# Altium schematic sheet level_shifter.SchDoc
size A4
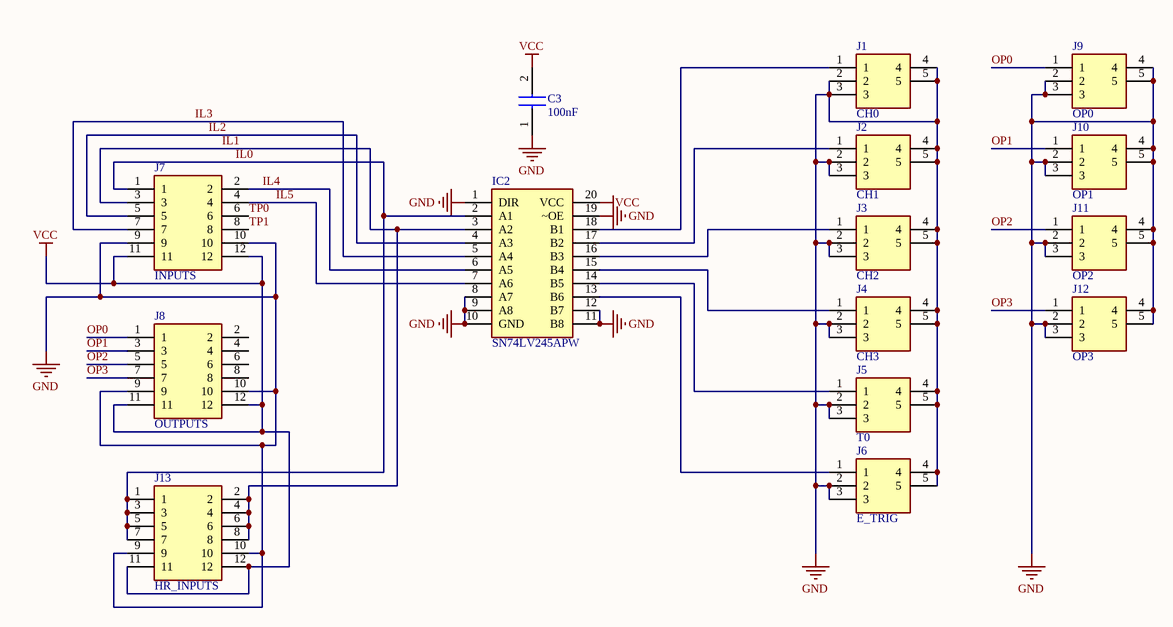
[diagram p0: level_shifter.SchDoc]

## Parts
C3  100nF  [CAPC1005X56N]
IC2  SN74LV245APW  [SOP65P640X120-20N]
J1  CH0  [142-0701-501]
J2  CH1  [142-0701-501]
J3  CH2  [142-0701-501]
J4  CH3  [142-0701-501]
J5  T0  [142-0701-501]
J6  E_TRIG  [142-0701-501]
J7  INPUTS  [HDRRA12W64P254_2X6_1524X254X610P]
J8  OUTPUTS  [HDRRA12W64P254_2X6_1524X254X610P]
J9  OP0  [142-0701-501]
J10  OP1  [142-0701-501]
J11  OP2  [142-0701-501]
J12  OP3  [142-0701-501]
J13  HR_INPUTS  [HDRRA12W64P254_2X6_1524X254X610P]

## Nets
GND: C3.1 IC2.1(DIR) IC2.8(A7) IC2.9(A8) IC2.10(GND) IC2.11(B8) IC2.12(B7) IC2.19(~OE) J1.2 J1.3 J1.4 J1.5 J2.2 J2.3 J2.4 J2.5 J3.2 J3.3 J3.4 J3.5 J4.2 J4.3 J4.4 J4.5 J5.2 J5.3 J5.4 J5.5 J6.2 J6.3 J6.4 J6.5 J7.9 J7.10 J8.9 J8.10 J9.2 J9.3 J9.4 J9.5 J10.2 J10.3 J10.4 J10.5 J11.2 J11.3 J11.4 J11.5 J12.2 J12.3 J12.4 J12.5 J13.9 J13.10
VCC: C3.2 IC2.20(VCC) J7.11 J7.12 J8.11 J8.12 J13.11 J13.12
IL0: IC2.2(A1) J7.1 J13.1 J13.3 J13.5 J13.7
IL1: IC2.3(A2) J7.3 J13.2 J13.4 J13.6 J13.8
IL2: IC2.4(A3) J7.5
IL3: IC2.5(A4) J7.7
IL4: IC2.6(A5) J7.2
IL5: IC2.7(A6) J7.4
OP0: J8.1 J9.1
OP1: J8.3 J10.1
OP2: J8.5 J11.1
OP3: J8.7 J12.1
TP0: J7.6
TP1: J7.8
NetIC2_13: IC2.13(B6) J6.1
NetIC2_14: IC2.14(B5) J5.1
NetIC2_15: IC2.15(B4) J4.1
NetIC2_16: IC2.16(B3) J3.1
NetIC2_17: IC2.17(B2) J2.1
NetIC2_18: IC2.18(B1) J1.1

Not connected (* = marked no-connect by the designer): J8 2 4 6 8

## Library data of the parts
C3 = 0402YC104MAT2A: Capacitor; Manufacturer_Name: AVX; Datasheet Link: http://www.mouser.com/catalog/supplier/library/pdf/AVXSurfaceMountCeramic.pdf; Height: 0.56mm; Manufacturer_Part_Number: 0402YC104MAT2A; Mouser Part Number: 581-0402YC104MAT2A; Mouser Price/Stock: https://www.mouser.com/Search/Refine.aspx?Keyword=581-0402YC104MAT2A
IC2 = SN74LV245APW: Integrated Circuit; Manufacturer_Name: Texas Instruments; Datasheet Link: http://www.ti.com/lit/gpn/SN74LV245A; Manufacturer_Part_Number: SN74LV245APW; Mouser Part Number: 595-SN74LV245APW; Mouser Price/Stock: https://www.mouser.com/Search/Refine.aspx?Keyword=595-SN74LV245APW; RS Part Number: 4394371; RS Price/Stock: https://uk.rs-online.com/web/p/products/4394371
J1-J6 J9-J12 = 142-0701-501: Connector; Manufacturer_Name: Cinch; Datasheet Link: http://uk.rs-online.com/web/p/products/8859850; RS Part Number: 8859850; RS Price/Stock: http://uk.rs-online.com/web/p/products/8859850; Manufacturer_Part_Number: 142-0701-501
J7 J8 J13 = TSW-106-08-L-D-RA: Connector; Manufacturer_Name: SAMTEC; Datasheet Link: http://suddendocs.samtec.com/catalog_english/tsw_th.pdf; Height: 6.1mm; Manufacturer_Part_Number: TSW-106-08-L-D-RA; Mouser Part Number: 200-TSW10608LDRA; Mouser Price/Stock: https://www.mouser.com/Search/Refine.aspx?Keyword=200-TSW10608LDRA; RS Part Number: 7670934P; RS Price/Stock: http://uk.rs-online.com/web/p/products/7670934P